# Altium schematic sheet FlightController.SchDoc
size A4
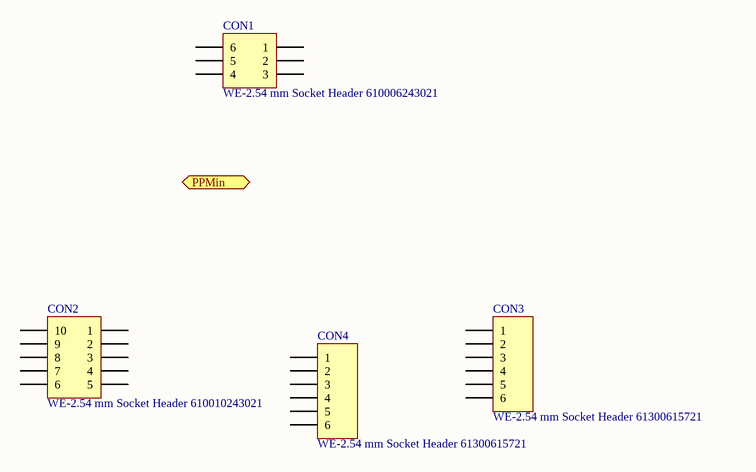
[diagram p0: FlightController.SchDoc]

## Parts
CON1  WE-2.54 mm Socket Header 610006243021  [610006243021]
CON2  WE-2.54 mm Socket Header 610010243021  [610010243021]
CON3  WE-2.54 mm Socket Header 61300615721  [61300615721]
CON4  WE-2.54 mm Socket Header 61300615721  [61300615721]

## Ports
PPMin

## Nets

Not connected (* = marked no-connect by the designer): CON1 1 2 3 4 5 6; CON2 1 2 3 4 5 6 7 8 9 10; CON3 1 2 3 4 5 6; CON4 1 2 3 4 5 6

## Library data of the parts
CON1 = WE-2.54 mm Socket Header 610006243021: WR-PHD 2.54 mm SMT Dual Socket Header Bottom Entry; Manufacturer: W¨¹rth Elektronik eiSos GmbH; ComponentLink1 Description: Manufacturer; ComponentLink2 Description: Datasheet; NoPins: 06; Created Date: 29 March 2013; partNo: 610006243021; ComponentLink1URL: http://www.we-online.com; ComponentLink2URL: http://katalog.we-online.de/em/datasheet/6100xx243021.pdf; Created by: Karrer Zheng
CON2 = WE-2.54 mm Socket Header 610010243021: WR-PHD 2.54 mm SMT Dual Socket Header Bottom Entry; Manufacturer: W¨¹rth Elektronik eiSos GmbH; ComponentLink1 Description: Manufacturer; ComponentLink2 Description: Datasheet; NoPins: 10; Created Date: 29 March 2013; partNo: 610010243021; ComponentLink1URL: http://www.we-online.com; ComponentLink2URL: http://katalog.we-online.de/em/datasheet/6100xx243021.pdf; Created by: Karrer Zheng
CON3 CON4 = WE-2.54 mm Socket Header 61300615721: WR-PHD 2.54 mm Socket Header Bottom Entry; Manufacturer: W¨¹rth Elektronik eiSos GmbH; ComponentLink1 Description: Manufacturer; ComponentLink2 Description: Datasheet; NoPins: 06; Created Date: 1 April 2013; partNo: 61300615721; ComponentLink1URL: http://www.we-online.com; ComponentLink2URL: http://katalog.we-online.de/em/datasheet/6130xx15721.pdf; Created by: Karrer Zheng